# Altium schematic sheet Backplane-Connector.SchDoc
size A3; DocumentNumber: 3; SheetNumber: 3; SheetTotal: 9; PageSetup: Record=PageOptions|CenterHorizontal=True|CenterVertical=True|PrintScale=0.97|XCorrection=1.00|YCorrection=1.00|PrintKind=1|BorderSize=5000000|LeftOffset=0|BottomOffset=0|Orientation=2|PaperLength=2970|PaperWidth=2100|Scale=100|PaperSource=7|PrintQuality=600|MediaType=1|DitherType=10|PaperKind=A4|PrintScaleMode=1
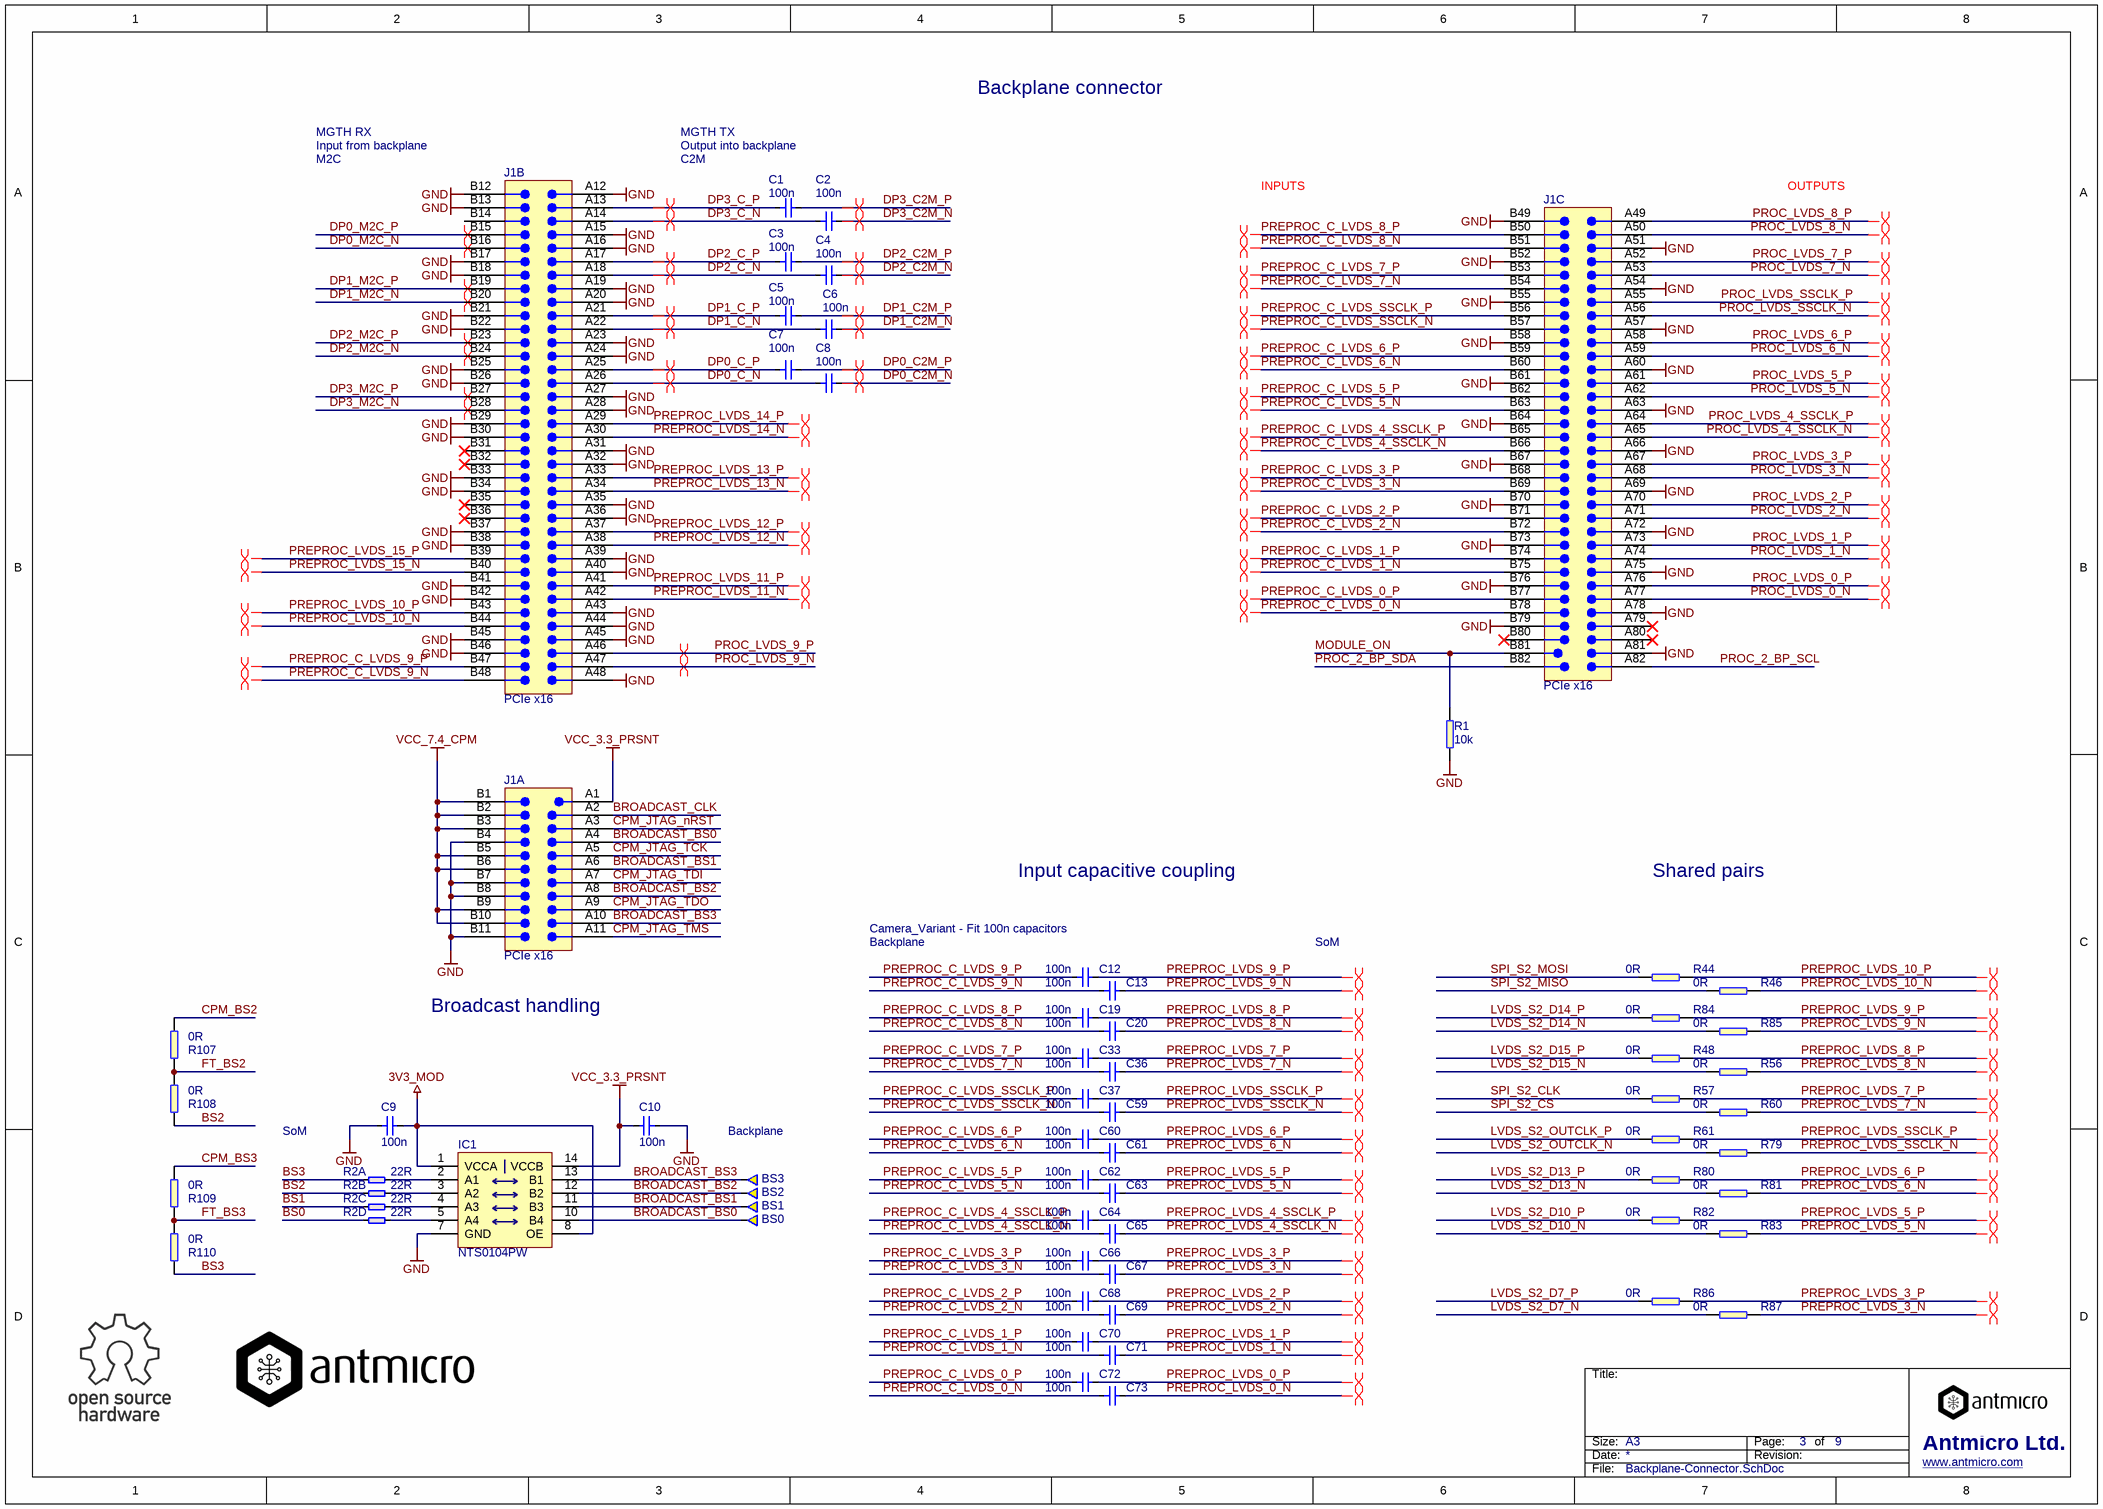
[diagram p0: Backplane-Connector.SchDoc]

## Parts
BS0  *  [Testpad]  (value not drawn)  (no BOM)
BS1  *  [Testpad]  (value not drawn)  (no BOM)
BS2  *  [Testpad]  (value not drawn)  (no BOM)
BS3  *  [Testpad]  (value not drawn)  (no BOM)
C1  100n  [0402]
C2  100n  [0402]
C3  100n  [0402]
C4  100n  [0402]
C5  100n  [0402]
C6  100n  [0402]
C7  100n  [0402]
C8  100n  [0402]
C9  100n  [0402]
C10  100n  [0402]
C12  100n  [0402]
C13  100n  [0402]
C19  100n  [0402]
C20  100n  [0402]
C33  100n  [0402]
C36  100n  [0402]
C37  100n  [0402]
C59  100n  [0402]
C60  100n  [0402]
C61  100n  [0402]
C62  100n  [0402]
C63  100n  [0402]
C64  100n  [0402]
C65  100n  [0402]
C66  100n  [0402]
C67  100n  [0402]
C68  100n  [0402]
C69  100n  [0402]
C70  100n  [0402]
C71  100n  [0402]
C72  100n  [0402]
C73  100n  [0402]
IC1  NTS0104PW  [TSSOP-14]
J1  PCIe x16  [PCIe_x16_card_edge]  (parts A,B,C of 3)  (no BOM)
R1  10k  [0603]
R2  22R  [BOURNS-CAY16-J4]  (parts A,B,C,D of 4)
R44  0R  [0402]
R46  0R  [0402]
R48  0R  [0402]
R56  0R  [0402]
R57  0R  [0402]
R60  0R  [0402]
R61  0R  [0402]
R79  0R  [0402]
R80  0R  [0402]
R81  0R  [0402]
R82  0R  [0402]
R83  0R  [0402]
R84  0R  [0402]
R85  0R  [0402]
R86  0R  [0402]
R87  0R  [0402]
R107  0R  [0402]
R108  0R  [0402]
R109  0R  [0402]
R110  0R  [0402]

## Nets
3V3_MOD: C9.2 IC1.1(VCCA) IC1.8(OE)
GND: C9.1 C10.1 IC1.7(GND) J1.A12 J1.A15 J1.A16 J1.A19 J1.A20 J1.A23 J1.A24 J1.A27 J1.A28 J1.A31 J1.A32 J1.A35 J1.A36 J1.A39 J1.A40 J1.A43 J1.A44 J1.A45 J1.A48 J1.A51 J1.A54 J1.A57 J1.A60 J1.A63 J1.A66 J1.A69 J1.A72 J1.A75 J1.A78 J1.A81 J1.B4 J1.B7 J1.B8 J1.B11 J1.B12 J1.B13 J1.B17 J1.B18 J1.B21 J1.B22 J1.B25 J1.B26 J1.B29 J1.B30 J1.B33 J1.B34 J1.B37 J1.B38 J1.B41 J1.B42 J1.B45 J1.B46 J1.B49 J1.B52 J1.B55 J1.B58 J1.B61 J1.B64 J1.B67 J1.B70 J1.B73 J1.B76 J1.B79 R1.1
VCC_3.3_PRSNT: C10.2 IC1.14(VCCB) J1.A1
VCC_7.4_CPM: J1.B1 J1.B2 J1.B3 J1.B5 J1.B6 J1.B9 J1.B10
BROADCAST_BS0: BS0.1 IC1.10(B4) J1.A4
BROADCAST_BS1: BS1.1 IC1.11(B3) J1.A6
BROADCAST_BS2: BS2.1 IC1.12(B2) J1.A8
BROADCAST_BS3: BS3.1 IC1.13(B1) J1.A10
BROADCAST_CLK: J1.A2
BS0: R2.7
BS1: R2.5
BS2: R2.3 R108.1
BS3: R2.1 R110.1
CPM_BS2: R107.2
CPM_BS3: R109.2
CPM_JTAG_nRST: J1.A3
CPM_JTAG_TCK: J1.A5
CPM_JTAG_TDI: J1.A7
CPM_JTAG_TDO: J1.A9
CPM_JTAG_TMS: J1.A11
DP0_C2M_N: C8.2
DP0_C2M_P: C7.2
DP0_C_N: C8.1 J1.A26
DP0_C_P: C7.1 J1.A25
DP0_M2C_N: J1.B16
DP0_M2C_P: J1.B15
DP1_C2M_N: C6.2
DP1_C2M_P: C5.2
DP1_C_N: C6.1 J1.A22
DP1_C_P: C5.1 J1.A21
DP1_M2C_N: J1.B20
DP1_M2C_P: J1.B19
DP2_C2M_N: C4.2
DP2_C2M_P: C3.2
DP2_C_N: C4.1 J1.A18
DP2_C_P: C3.1 J1.A17
DP2_M2C_N: J1.B24
DP2_M2C_P: J1.B23
DP3_C2M_N: C2.2
DP3_C2M_P: C1.2
DP3_C_N: C2.1 J1.A14
DP3_C_P: C1.1 J1.A13
DP3_M2C_N: J1.B28
DP3_M2C_P: J1.B27
FT_BS2: R107.1 R108.2
FT_BS3: R109.1 R110.2
LVDS_S2_D7_N: R87.1
LVDS_S2_D7_P: R86.1
LVDS_S2_D10_N: R83.1
LVDS_S2_D10_P: R82.1
LVDS_S2_D13_N: R81.1
LVDS_S2_D13_P: R80.1
LVDS_S2_D14_N: R85.1
LVDS_S2_D14_P: R84.1
LVDS_S2_D15_N: R56.1
LVDS_S2_D15_P: R48.1
LVDS_S2_OUTCLK_N: R79.1
LVDS_S2_OUTCLK_P: R61.1
MODULE_ON: J1.B81 R1.2
PREPROC_C_LVDS_0_N: C73.1 J1.B78
PREPROC_C_LVDS_0_P: C72.1 J1.B77
PREPROC_C_LVDS_1_N: C71.1 J1.B75
PREPROC_C_LVDS_1_P: C70.1 J1.B74
PREPROC_C_LVDS_2_N: C69.1 J1.B72
PREPROC_C_LVDS_2_P: C68.1 J1.B71
PREPROC_C_LVDS_3_N: C67.1 J1.B69
PREPROC_C_LVDS_3_P: C66.1 J1.B68
PREPROC_C_LVDS_4_SSCLK_N: C65.1 J1.B66
PREPROC_C_LVDS_4_SSCLK_P: C64.1 J1.B65
PREPROC_C_LVDS_5_N: C63.1 J1.B63
PREPROC_C_LVDS_5_P: C62.1 J1.B62
PREPROC_C_LVDS_6_N: C61.1 J1.B60
PREPROC_C_LVDS_6_P: C60.1 J1.B59
PREPROC_C_LVDS_7_N: C36.1 J1.B54
PREPROC_C_LVDS_7_P: C33.1 J1.B53
PREPROC_C_LVDS_8_N: C20.1 J1.B51
PREPROC_C_LVDS_8_P: C19.1 J1.B50
PREPROC_C_LVDS_9_N: C13.1 J1.B48
PREPROC_C_LVDS_9_P: C12.1 J1.B47
PREPROC_C_LVDS_SSCLK_N: C59.1 J1.B57
PREPROC_C_LVDS_SSCLK_P: C37.1 J1.B56
PREPROC_LVDS_0_N: C73.2
PREPROC_LVDS_0_P: C72.2
PREPROC_LVDS_1_N: C71.2
PREPROC_LVDS_1_P: C70.2
PREPROC_LVDS_2_N: C69.2
PREPROC_LVDS_2_P: C68.2
PREPROC_LVDS_3_N: C67.2 R87.2
PREPROC_LVDS_3_P: C66.2 R86.2
PREPROC_LVDS_4_SSCLK_N: C65.2
PREPROC_LVDS_4_SSCLK_P: C64.2
PREPROC_LVDS_5_N: C63.2 R83.2
PREPROC_LVDS_5_P: C62.2 R82.2
PREPROC_LVDS_6_N: C61.2 R81.2
PREPROC_LVDS_6_P: C60.2 R80.2
PREPROC_LVDS_7_N: C36.2 R60.2
PREPROC_LVDS_7_P: C33.2 R57.2
PREPROC_LVDS_8_N: C20.2 R56.2
PREPROC_LVDS_8_P: C19.2 R48.2
PREPROC_LVDS_9_N: C13.2 R85.2
PREPROC_LVDS_9_P: C12.2 R84.2
PREPROC_LVDS_10_N: J1.B44 R46.2
PREPROC_LVDS_10_P: J1.B43 R44.2
PREPROC_LVDS_11_N: J1.A42
PREPROC_LVDS_11_P: J1.A41
PREPROC_LVDS_12_N: J1.A38
PREPROC_LVDS_12_P: J1.A37
PREPROC_LVDS_13_N: J1.A34
PREPROC_LVDS_13_P: J1.A33
PREPROC_LVDS_14_N: J1.A30
PREPROC_LVDS_14_P: J1.A29
PREPROC_LVDS_15_N: J1.B40
PREPROC_LVDS_15_P: J1.B39
PREPROC_LVDS_SSCLK_N: C59.2 R79.2
PREPROC_LVDS_SSCLK_P: C37.2 R61.2
PROC_2_BP_SCL: J1.A82
PROC_2_BP_SDA: J1.B82
PROC_LVDS_0_N: J1.A77
PROC_LVDS_0_P: J1.A76
PROC_LVDS_1_N: J1.A74
PROC_LVDS_1_P: J1.A73
PROC_LVDS_2_N: J1.A71
PROC_LVDS_2_P: J1.A70
PROC_LVDS_3_N: J1.A68
PROC_LVDS_3_P: J1.A67
PROC_LVDS_4_SSCLK_N: J1.A65
PROC_LVDS_4_SSCLK_P: J1.A64
PROC_LVDS_5_N: J1.A62
PROC_LVDS_5_P: J1.A61
PROC_LVDS_6_N: J1.A59
PROC_LVDS_6_P: J1.A58
PROC_LVDS_7_N: J1.A53
PROC_LVDS_7_P: J1.A52
PROC_LVDS_8_N: J1.A50
PROC_LVDS_8_P: J1.A49
PROC_LVDS_9_N: J1.A47
PROC_LVDS_9_P: J1.A46
PROC_LVDS_SSCLK_N: J1.A56
PROC_LVDS_SSCLK_P: J1.A55
SPI_S2_CLK: R57.1
SPI_S2_CS: R60.1
SPI_S2_MISO: R46.1
SPI_S2_MOSI: R44.1
NetIC1_2: IC1.2(A1) R2.2
NetIC1_3: IC1.3(A2) R2.4
NetIC1_4: IC1.4(A3) R2.6
NetIC1_5: IC1.5(A4) R2.8

Not connected (* = marked no-connect by the designer): J1 A79* A80* B14 B31* B32* B35* B36* B80*

## Layout directives
differential pair; net class PREPROC_MGT: DP0_M2C_N, DP0_M2C_P, DP1_M2C_N, DP1_M2C_P, DP2_M2C_N, DP2_M2C_P, DP3_M2C_N, DP3_M2C_P
differential pair; net class PROC_LVDS: PREPROC_LVDS_10_N, PREPROC_LVDS_10_P, PREPROC_LVDS_11_N, PREPROC_LVDS_11_P, PREPROC_LVDS_12_N, PREPROC_LVDS_12_P, PREPROC_LVDS_13_N, PREPROC_LVDS_13_P, PREPROC_LVDS_14_N, PREPROC_LVDS_14_P, PREPROC_LVDS_15_N, PREPROC_LVDS_15_P, PROC_LVDS_9_N, PROC_LVDS_9_P
differential pair: DP0_C2M_N, DP0_C2M_P, DP0_C_N, DP0_C_P, DP1_C2M_N, DP1_C2M_P, DP1_C_N, DP1_C_P, DP2_C2M_N, DP2_C2M_P, DP2_C_N, DP2_C_P, DP3_C2M_N, DP3_C2M_P, DP3_C_N, DP3_C_P, PREPROC_C_LVDS_0_N, PREPROC_C_LVDS_0_P, PREPROC_C_LVDS_1_N, PREPROC_C_LVDS_1_P, PREPROC_C_LVDS_2_N, PREPROC_C_LVDS_2_P, PREPROC_C_LVDS_3_N, PREPROC_C_LVDS_3_P, PREPROC_C_LVDS_4_SSCLK_N, PREPROC_C_LVDS_4_SSCLK_P, PREPROC_C_LVDS_5_N, PREPROC_C_LVDS_5_P, PREPROC_C_LVDS_6_N, PREPROC_C_LVDS_6_P, PREPROC_C_LVDS_7_N, PREPROC_C_LVDS_7_P, PREPROC_C_LVDS_8_N, PREPROC_C_LVDS_8_P, PREPROC_C_LVDS_9_N, PREPROC_C_LVDS_9_P, PREPROC_C_LVDS_SSCLK_N, PREPROC_C_LVDS_SSCLK_P, PREPROC_LVDS_0_N, PREPROC_LVDS_0_P, PREPROC_LVDS_1_N, PREPROC_LVDS_1_P, PREPROC_LVDS_2_N, PREPROC_LVDS_2_P, PREPROC_LVDS_3_N, PREPROC_LVDS_3_P, PREPROC_LVDS_4_SSCLK_N, PREPROC_LVDS_4_SSCLK_P, PREPROC_LVDS_5_N, PREPROC_LVDS_5_P, PREPROC_LVDS_6_N, PREPROC_LVDS_6_P, PREPROC_LVDS_7_N, PREPROC_LVDS_7_P, PREPROC_LVDS_8_N, PREPROC_LVDS_8_P, PREPROC_LVDS_9_N, PREPROC_LVDS_9_P, PREPROC_LVDS_10_N, PREPROC_LVDS_10_P, PREPROC_LVDS_SSCLK_N, PREPROC_LVDS_SSCLK_P, PROC_LVDS_0_N, PROC_LVDS_0_P, PROC_LVDS_1_N, PROC_LVDS_1_P, PROC_LVDS_2_N, PROC_LVDS_2_P, PROC_LVDS_3_N, PROC_LVDS_3_P, PROC_LVDS_4_SSCLK_N, PROC_LVDS_4_SSCLK_P, PROC_LVDS_5_N, PROC_LVDS_5_P, PROC_LVDS_6_N, PROC_LVDS_6_P, PROC_LVDS_7_N, PROC_LVDS_7_P, PROC_LVDS_8_N, PROC_LVDS_8_P, PROC_LVDS_SSCLK_N, PROC_LVDS_SSCLK_P

## Notes on the sheet
- Backplane connector
- Input from backplane
- MGTH RX
- M2C
- Output into backplane
- MGTH TX
- C2M
- INPUTS
- OUTPUTS
- Input capacitive coupling
- Shared pairs
- Backplane
- Camera_Variant - Fit 100n capacitors
- SoM
- Broadcast handling
- Title:
- Size:
- Date:
- A3
- Revision:
- Page:
- of
- Antmicro Ltd.
- File:
- www.antmicro.com

## Library data of the parts
BS0-BS3 = Testpad: Testpad 2mm diameter; Part Number: Testpad
C1-C10 C12 C13 C19 C20 C33 C36 C37 C59-C73 = C_100n_0402: MLCC SMT Capacitor 100nF 0402; Manufacturer: MULTICOMP; MPN: MC0402X104M100CT; Value: 100n; Part Number: C_100n_0402
IC1 = NTS0104PW: 4 bit voltage level translator; Manufacturer: NXP; Part Number: NTS0104PW; Value: NTS0104PW; MPN: NTS0104PW
J1 = PCIe x16: PCI Express x16 164 2.36 mm; Part Number: 10018783-10113TLF; MPN: generic; Value: generic; Manufacturer: generic
R1 = R_10k_0603: SMT Resistor 10k 0603; Manufacturer: BOURNS; MPN: CR0603-JW-103ELF; Value: 10k; Part Number: R_10k_0603
R2 = CAY16-220J4LF: Bourns, 4 x 22R, CAY16; Part Number: CAY16-220J4LF; Value: 22R; Manufacturer: BOURNS; MPN: CAY16-220J4LF
R44 R46 R48 R56 R57 R60 R61 R79-R87 R107-R110 = R_0R_0402: SMT Resistor 0402; Manufacturer: MULTICOMP; MPN: MCMR04X000 PTL; Part Number: R_0R_0402; Value: 0R